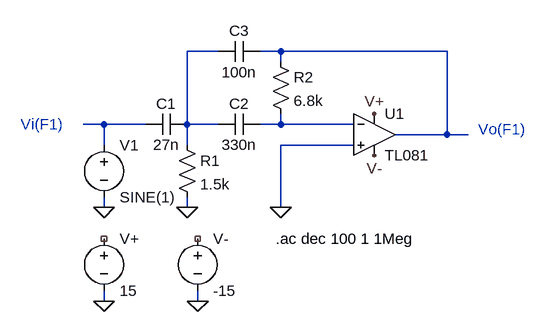
[diagram p0: schematic filter_2nd_order_mf_in.asc]
filter_2nd_order_mf_in.asc, the LTspice schematic file:
Version 4
SHEET 1 880 720
WIRE 288 -48 240 -48
WIRE 384 -48 352 -48
WIRE 640 -48 384 -48
WIRE 384 -32 384 -48
WIRE 112 64 80 64
WIRE 176 64 112 64
WIRE 240 64 240 -48
WIRE 288 64 240 64
WIRE 384 64 384 48
WIRE 384 64 352 64
WIRE 496 64 384 64
WIRE 640 80 640 -48
WIRE 640 80 560 80
WIRE 672 80 640 80
WIRE 112 96 112 64
WIRE 240 96 240 64
WIRE 496 96 384 96
WIRE 112 192 112 176
WIRE 240 192 240 176
WIRE 384 192 384 96
WIRE 112 336 112 320
WIRE 256 336 256 320
FLAG 240 192 0
FLAG 384 192 0
FLAG 112 192 0
FLAG 112 336 0
FLAG 256 336 0
FLAG 528 48 V+
FLAG 528 112 V-
SYMBOL cap 240 48 R90
WINDOW 0 0 32 VBottom 2
WINDOW 3 32 32 VTop 2
SYMATTR InstName C1
SYMATTR Value 27n
SYMBOL res 224 80 R0
SYMATTR InstName R1
SYMATTR Value 1.5k
SYMBOL cap 352 48 R90
WINDOW 0 0 32 VBottom 2
WINDOW 3 32 32 VTop 2
SYMATTR InstName C2
SYMATTR Value 330n
SYMBOL res 368 -48 R0
SYMATTR InstName R2
SYMATTR Value 6.8k
SYMBOL cap 352 -64 R90
WINDOW 0 0 32 VBottom 2
WINDOW 3 32 32 VTop 2
SYMATTR InstName C3
SYMATTR Value 100n
SYMBOL voltage 112 80 R0
SYMATTR InstName V1
SYMATTR Value SINE(1)
SYMATTR Value2 AC 1 0
SYMBOL voltage 112 224 R0
SYMATTR InstName V+
SYMATTR Value 15
SYMBOL voltage 256 224 R0
SYMATTR InstName V-
SYMATTR Value -15
SYMBOL AutoGenerated/TL081 528 80 R0
SYMATTR InstName U1
TEXT 376 240 Left 2 !.ac dec 100 1 1Meg
TEXT -16 64 Left 2 ;Vi(F1)
TEXT 688 72 Left 2 ;Vo(F1)

The netlist it stands for:
* filter_2nd_order_mf_in.asc
C1 N001 N003 27n
R1 N001 0 1.5k
C2 N004 N001 330n
R2 N002 N004 6.8k
C3 N002 N001 100n
V1 N003 0 SINE(1) AC 1 0
V+ NC_01 0 15
V- NC_02 0 -15
* U1: TL081 (symbol AutoGenerated/TL081 not available, pins judged from their places): In+=0 In-=N004 V+=V+ V-=V- OUT=N002
.ac dec 100 1 1Meg
* Vi(F1)
* Vo(F1)
.backanno
.end